# Altium schematic sheet LDO_3V3.SchDoc
size A4; SheetNumber: 3; SheetTotal: 4
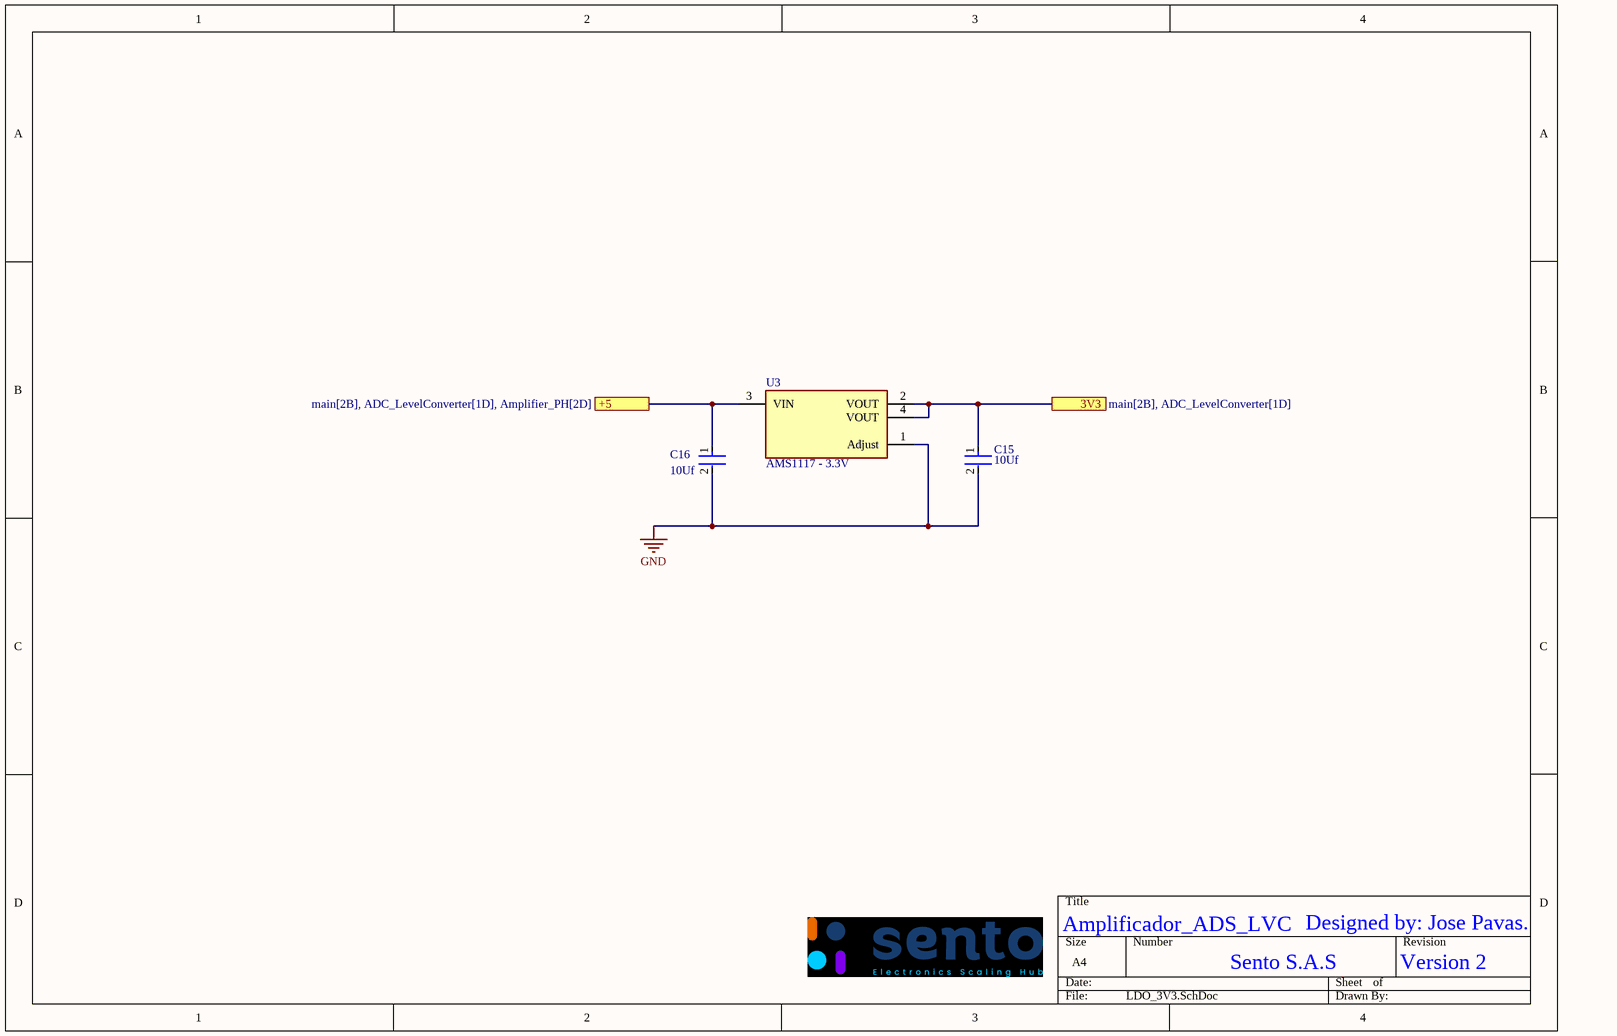
[diagram p0: LDO_3V3.SchDoc]

## Parts
C15  10Uf  [FP-GRM188-0_1-e0_2_0_55-IPC_A]
C16  10Uf  [FP-GRM188-0_1-e0_2_0_55-IPC_A]
U3  AMS1117 - 3.3V  [FP-ams1117-IPC_C]

## Ports
3V3 (see main[2B], ADC_LevelConverter[1D]), +5 (see main[2B], ADC_LevelConverter[1D], Amplifier_PH[2D])

## Nets
GND: C15.2 C16.2 U3.1(Adjust)
3V3: C15.1 U3.2(VOUT) U3.4(VOUT) ; port 3V3
+5: C16.1 U3.3(VIN) ; port +5

## Notes on the sheet
- Amplificador_ADS_LVC
- Sento S.A.S
- Designed by: Jose Pavas.
- Version 2

## Library data of the parts
C15 C16 = CMP-2006-02792-2: Chip Multilayer Ceramic Capacitors for General Purpose, 0603, 10uF, X5R, 15%, 20%, 6.3V; Packaging: Tape and Reel; Voltage Rating (DC): 6.3V; Width: 0.031inch; Termination: SMD/SMT; Dielectric: X5R; Package Quantity: 4000; Voltage Rating: 6.3V; Capacitance: 10uF; Case/Package: 0603; Min Operating Temperature: -55°C; Voltage: 6.3V; Length: 1.6mm; Thickness: 0.035inch; Lead Free: Lead Free; Depth: 0.8mm; Case Code (Imperial): 0603; Max Operating Temperature: 85°C; Material: Ceramic; Height: 0.8mm; Tolerance: 20%; Mount: Surface Mount; REACH SVHC: No SVHC; Radiation Hardening: No; Case Code (Metric): 1608; LCSC Part Number: C19702
U3 = CMP-209535-000002-1: 1A LOW DROPOUT VOLTAGE REGULATOR; RoHS Compliant: Yes; LCSC Part Number: C5250992